# Altium schematic sheet ZOWI_Main_Board_Power.SchDoc: Power
size A4; Date: 20140218; Author: Raúl de Pablos; CompanyName: bq - Mundo Reader; Organization: bq - Mundo Reader; DocumentNumber: 7; Revision: 2.5; SheetNumber: 7; SheetTotal: 8; ProjectName: ZUM BT328
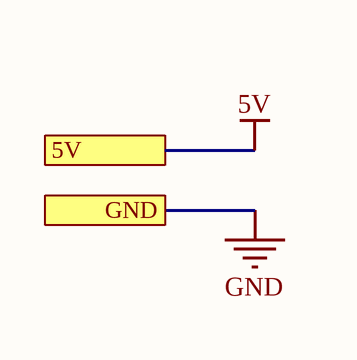
[diagram p0: ZOWI_Main_Board_Power.SchDoc]

## Ports
5V, GND

## Nets
5V: port 5V
GND: port GND

## Notes on the sheet
- Confidential
- Title
- Project
- Size:
- Author
- A4
- Number:
- Revision:
- Date:
- Time:
- Sheet
- of